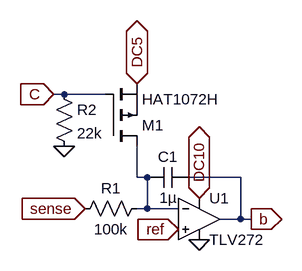
[diagram p0: schematic FeedbackControl.asc]
FeedbackControl.asc, the LTspice schematic file:
Version 4
SHEET 1 880 680
WIRE 128 48 112 48
WIRE 192 48 128 48
WIRE 240 176 240 128
WIRE 256 176 240 176
WIRE 400 176 320 176
WIRE 256 224 256 176
WIRE 256 224 240 224
WIRE 304 224 256 224
WIRE 400 240 400 176
WIRE 400 240 368 240
WIRE 416 240 400 240
FLAG 416 240 b
IOPIN 416 240 Out
FLAG 160 224 sense
IOPIN 160 224 In
FLAG 304 256 ref
IOPIN 304 256 In
FLAG 336 208 DC10
IOPIN 336 208 BiDir
FLAG 336 272 0
FLAG 240 32 DC5
IOPIN 240 32 BiDir
FLAG 128 128 0
FLAG 112 48 C
IOPIN 112 48 In
SYMBOL res 256 208 R90
WINDOW 0 0 56 VBottom 2
WINDOW 3 32 56 VTop 2
SYMATTR InstName R1
SYMATTR Value 100k
SYMBOL cap 320 160 R90
WINDOW 0 0 32 VBottom 2
WINDOW 3 32 32 VTop 2
SYMATTR InstName C1
SYMATTR Value 1µ
SYMBOL Misc\\TLV272 336 240 R0
SYMATTR InstName U1
SYMBOL pmos 192 128 M180
SYMATTR InstName M1
SYMATTR Value HAT1072H
SYMBOL res 112 32 R0
SYMATTR InstName R2
SYMATTR Value 22k

The netlist it stands for:
* FeedbackControl.asc
R1 N001 sense 100k
C1 b N001 1µ
* U1: TLV272 (symbol Misc\TLV272 not available, pins judged from their places): In+=ref In-=N001 V+=DC10 V-=0 OUT=b
M1 N001 C DC5 DC5 HAT1072H
R2 C 0 22k
.model NMOS NMOS
.model PMOS PMOS
.lib standard.mos
.backanno
.end